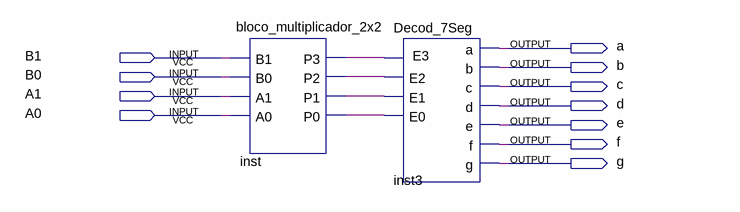
[diagram p0: schematic sheet]
// Quartus schematic multiplicador_blocos.bdf as structural Verilog: 2 symbols, 11 pins
module multiplicador_blocos (
  input  B1,
  input  B0,
  input  A1,
  input  A0,
  output a,
  output b,
  output c,
  output d,
  output e,
  output f,
  output g
);

  wire inst_p0, inst_p1, inst_p2, inst_p3;

  bloco_multiplicador_2x2 inst (
    .B1(B1), .B0(B0), .A1(A1), .A0(A0), .P3(inst_p3), .P2(inst_p2), .P1(inst_p1), .P0(inst_p0));
  Decod_7Seg inst3 (
    .E3(inst_p3), .E2(inst_p2), .E1(inst_p1), .E0(inst_p0), .a(a), .b(b), .c(c), .d(d), .e(e), .f(f), .g(g));
endmodule
